# EasyEDA Pro project ProPrj_gzy_2025-03-24.epro

# Schematic Schematic1
Board Name: Board1; Create Date: 2025-03-19; Page Name: P1; Project Name: gzy; Schematic Name: Schematic1; Update Date: 2025-03-19; Company: 嘉立创EDA; Page Size: A4; Version: V1.0
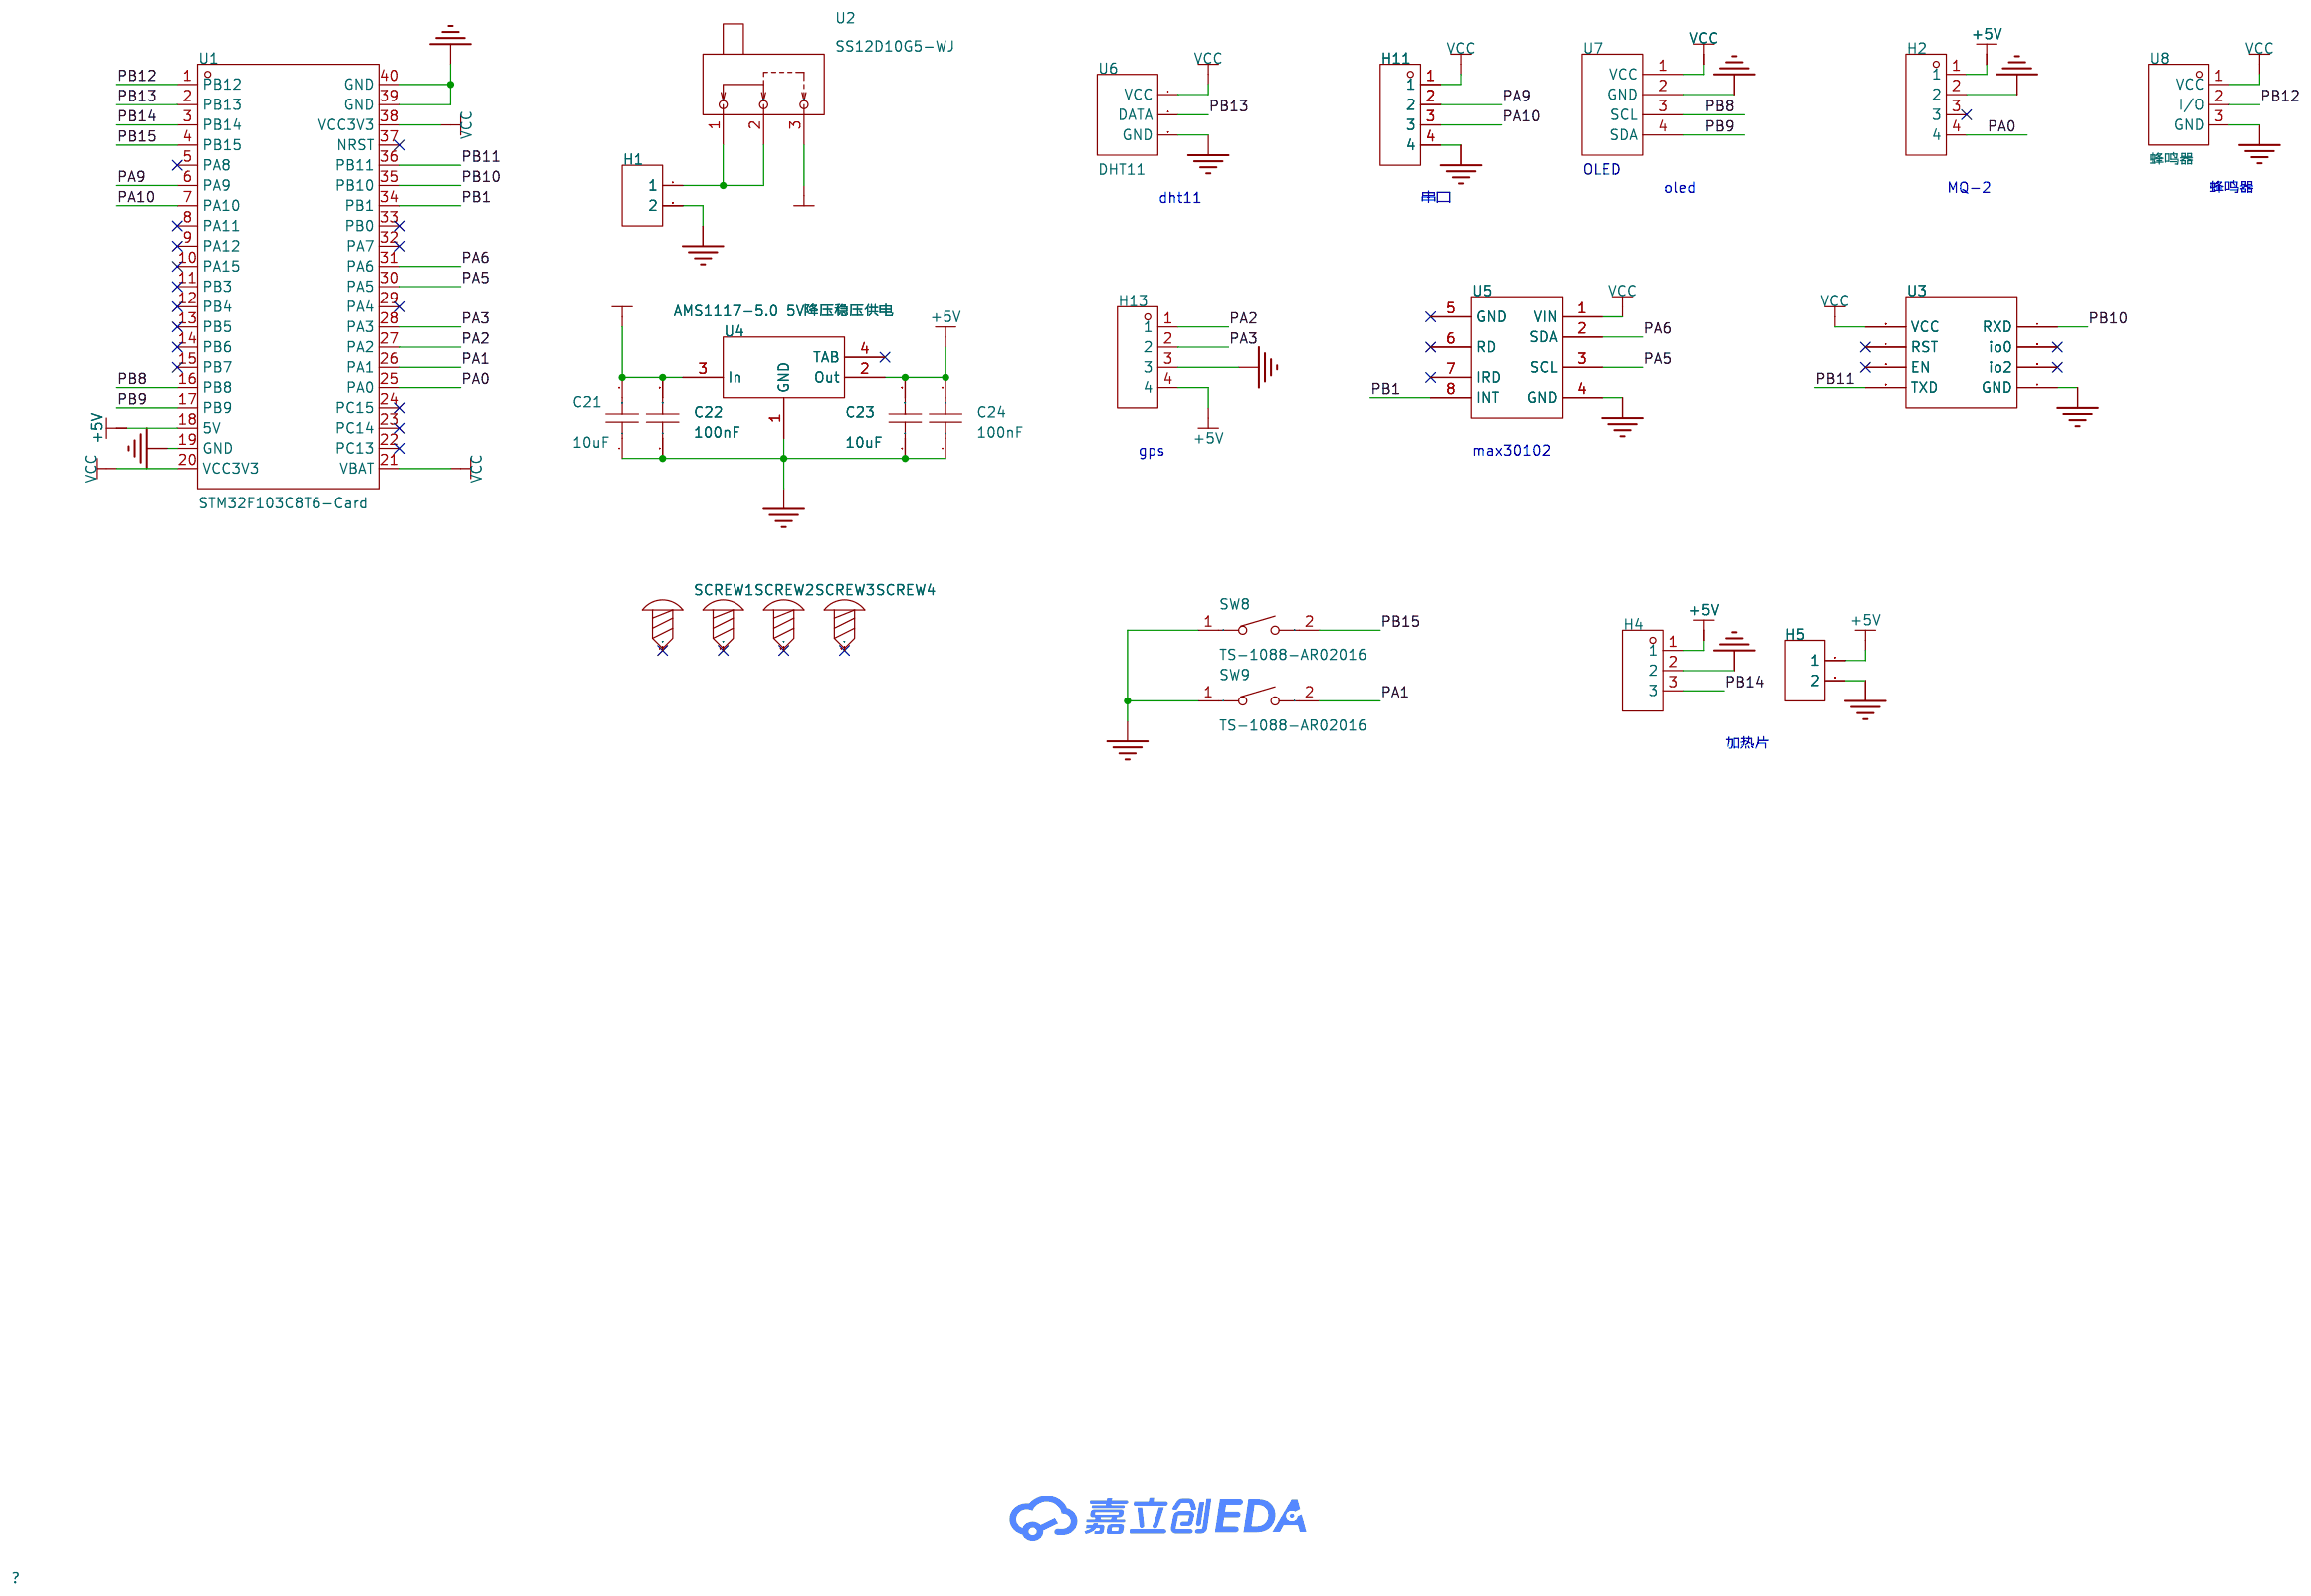
[diagram p0: schematic sheet]

## Parts
C21  10uF  [C0805]
C22  100nF  [C0805]
C23  10uF  [C0805]
C24  100nF  [C0805]
H1  -  [HDR-TH_2P-P2.54-V-F]
H2  -  [HDR-TH_4P-P2.54-V-F]
H4  -  [HDR-TH_3P-P2.54-V-F]
H5  -  [HDR-TH_2P-P2.54-V-F]
H11  -  [HDR-TH_4P-P2.54-V-F]
H13  -  [HDR-TH_4P-P2.54-V-F]
SCREW1  -  [M3螺丝]
SCREW2  -  [M3螺丝]
SCREW3  -  [M3螺丝]
SCREW4  -  [M3螺丝]
SW8  TS-1088-AR02016  [SW-SMD_L3.9-W3.0-P4.45]
SW9  TS-1088-AR02016  [SW-SMD_L3.9-W3.0-P4.45]
U1  STM32F103C8T6-Card  [CONN-TH_L53.3-W22.9_STM32F103C8T6-CARD]
U2  SS12D10G5-WJ  [SW-TH_3P-SS12D06-1]
U3  -  [esp8266-01s]
U4  AMS1117-5.0 5V降压稳压供电  [SOT-223_L6.5-W3.5-P2.30-LS7.0-BR]
U5  -  [MAX30102]
U6  DHT11  [DHT11_X]
U7  -  [0.96OLED_4P]
U8  蜂鸣器  [蜂鸣器]

## Library data of the parts
C21-C24 = CAP_0805: Supplier Footprint: 0805
H1 H5 = HDR-F_2.54_1x2P: Supplier Part: C49661; Supplier Footprint: 插件
H2 H11 H13 = HDR-F_2.54_1x4P: Supplier Part: C2718488; Supplier Footprint: 插件
H4 = HDR-F_2.54_1x3P: Supplier Part: C541850; Supplier Footprint: 插件
SCREW1-SCREW4 = M3螺丝: Supplier Footprint: 插件
SW8 SW9 = TS-1088-AR02016: 电路结构:单刀单掷;按钮形状:圆形按钮;作用力:160gf;安装方式:立贴;开关长度:4mm;开关宽度:3mm;开关高度:2mm;带支架:不带;触点电流:50mA;额定电压(DC):12V;绝缘电阻:100MΩ;机械寿命:10万次;; LCSC Part Name: 4*3*2mm 立贴 轻触开关; Supplier Part: C720477; Manufacturer: XUNPU(讯普); Supplier Footprint: SMD; JLCPCB Part Class: Extended Part; Datasheet: https://atta.szlcsc.com/upload/public/pdf/source/20200810/C720475_60D09DD6C54279ADDB2DC25100F1CC11.pdf; Supplier: LCSC; Circuit: 单刀单掷; Actuator Style: 圆形按钮; Operating Force: 160gf; Mounting Style: 立贴; Switch Length: 4mm; Switch Width: 3mm; Switch Height: 2mm; Strike Gundam: 不带; Contact Current: 50mA; Voltage Rating (DC): 12V; Insulation Resistance: 100MΩ; Actuator/Cap Color: 黑色; Pin Style: SMD接片; Mechanical Life: 10万次; Operating Temperature: -30℃~+80℃
U1 = STM32F103C8T6-Card: Supplier Part: C9900077949; Supplier Footprint: 插件; Supplier: LCSC
U2 = SS12D10G5-WJ: 电路结构:单刀双掷;安装方式:直插;额定电流(DC):2A;额定电压(DC):125V;机械寿命:3千次;; LCSC Part Name: 两档卧式插件 3脚拨动开关弯插 柄长5.0mm; Supplier Part: C7431058; Manufacturer: SHOU HAN(首韩); Supplier Footprint: 插件; JLCPCB Part Class: 扩展库; Datasheet: https://atta.szlcsc.com/upload/public/pdf/source/20230621/24203FB22DE8BDD2A5BD75F3B5E716C8.pdf; Supplier: LCSC; Circuit: 单刀双掷; Switch Length: 12.7mm; Switch Width: 6.7mm; Mounting Style: 直插; Current Rating (DC): 2A; Voltage Rating (DC): 125V; Mechanical Life: 3千次; Operating Temperature: -25℃~+70℃
U3 = esp8266-01s: esp8266-01swifi模块
U4 = AMS1117-5.0 5V降压稳压供电: Pin Type: IN; Supplier: LCSC; Manufacturer: AMS; Manufacturer Part: AMS1117-5.0; Supplier Part: C6187; JLCPCB Part Class: Basic Part
U5 = max30102: _: 3
U6 = DHT11: Supplier Part: C115245; Supplier: LCSC
U7 = OLED
U8 = 蜂鸣器: Supplier Part: C9900010938; Datasheet: https://atta.szlcsc.comnull; Supplier: LCSC

## Nets
+5V: C23.2 C24.2 H2.1 H4.1 H5.1 H13.4 U1.18(5V) U4.2(Out)
+7V: C21.2 C22.2 U2.3 U4.3(In)
GND: C21.1 C22.1 C23.1 C24.1 H1.2 H2.2 H4.2 H5.2 H11.4 H13.3 SW8.1 SW9.1 U1.19(GND) U1.39(GND) U1.40(GND) U3.1(GND) U4.1(GND) U5.4(GND) U6.3(GND) U7.2(GND) U8.3(GND)
VCC: H11.1 U1.20(VCC3V3) U1.21(VBAT) U1.38(VCC3V3) U3.8(VCC) U5.1(VIN) U6.1(VCC) U7.1(VCC) U8.1(VCC)
PA0: H2.4 U1.25(PA0)
PA1: SW9.2 U1.26(PA1)
PA2: H13.1 U1.27(PA2)
PA3: H13.2 U1.28(PA3)
PA5: U1.30(PA5) U5.3(SCL)
PA6: U1.31(PA6) U5.2(SDA)
PA9: H11.2 U1.6(PA9)
PA10: H11.3 U1.7(PA10)
PB1: U1.34(PB1) U5.8(INT)
PB8: U1.16(PB8) U7.3(SCL)
PB9: U1.17(PB9) U7.4(SDA)
PB10: U1.35(PB10) U3.4(RXD)
PB11: U1.36(PB11) U3.5(TXD)
PB12: U1.1(PB12) U8.2(I/O)
PB13: U1.2(PB13) U6.2(DATA)
PB14: H4.3 U1.3(PB14)
PB15: SW8.2 U1.4(PB15)
$1N445: H1.1 U2.1 U2.2

Not connected (* = marked no-connect by the designer): H2 3*; SCREW1 1*; SCREW2 1*; SCREW3 1*; SCREW4 1*; U1 5(PA8)* 8(PA11)* 9(PA12)* 10(PA15)* 11(PB3)* 12(PB4)* 13(PB5)* 14(PB6)* 15(PB7)* 22(PC13)* 23(PC14)* 24(PC15)* 29(PA4)* 32(PA7)* 33(PB0)* 37(NRST)*; U3 2(io2)* 3(io0)* 6(EN)* 7(RST)*; U4 4(TAB)*; U5 5(GND)* 6(RD)* 7(IRD)*

## Notes on the sheet
- oled
- MQ-2
- 蜂鸣器
- dht11
- 串口
- gps
- max30102
- 加热片

# Board PCB1
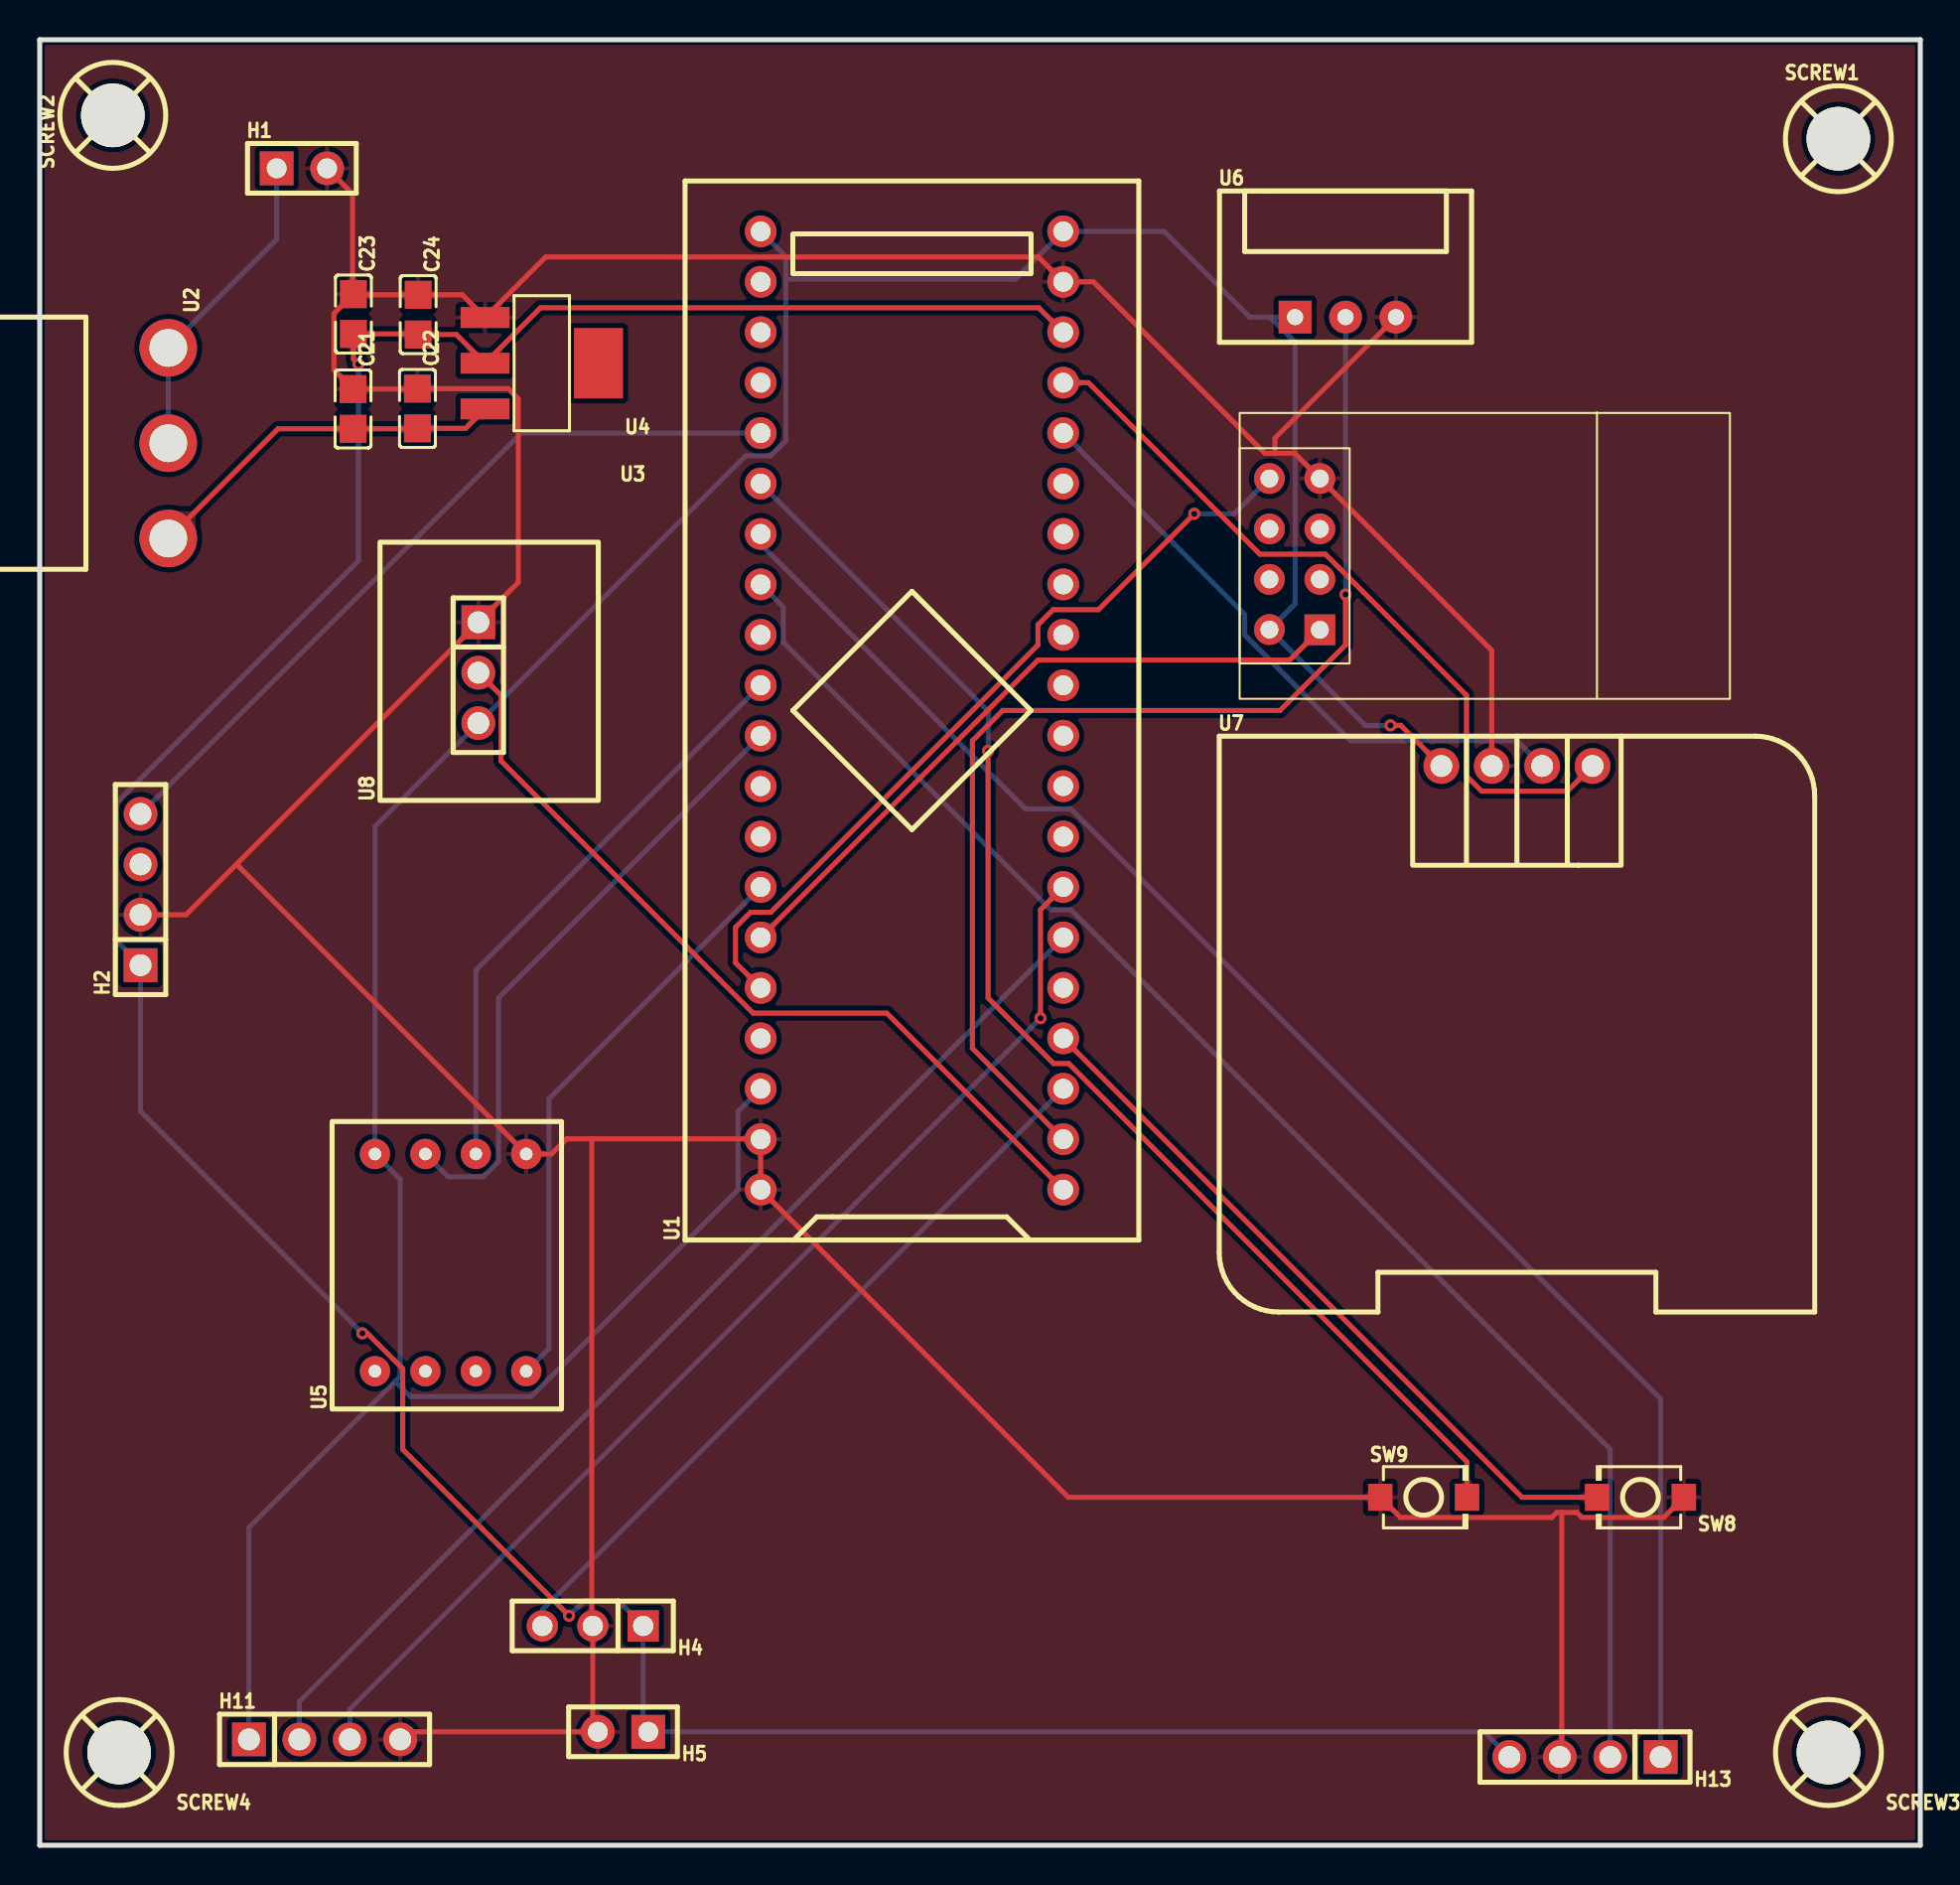
[diagram p1: board, top side]
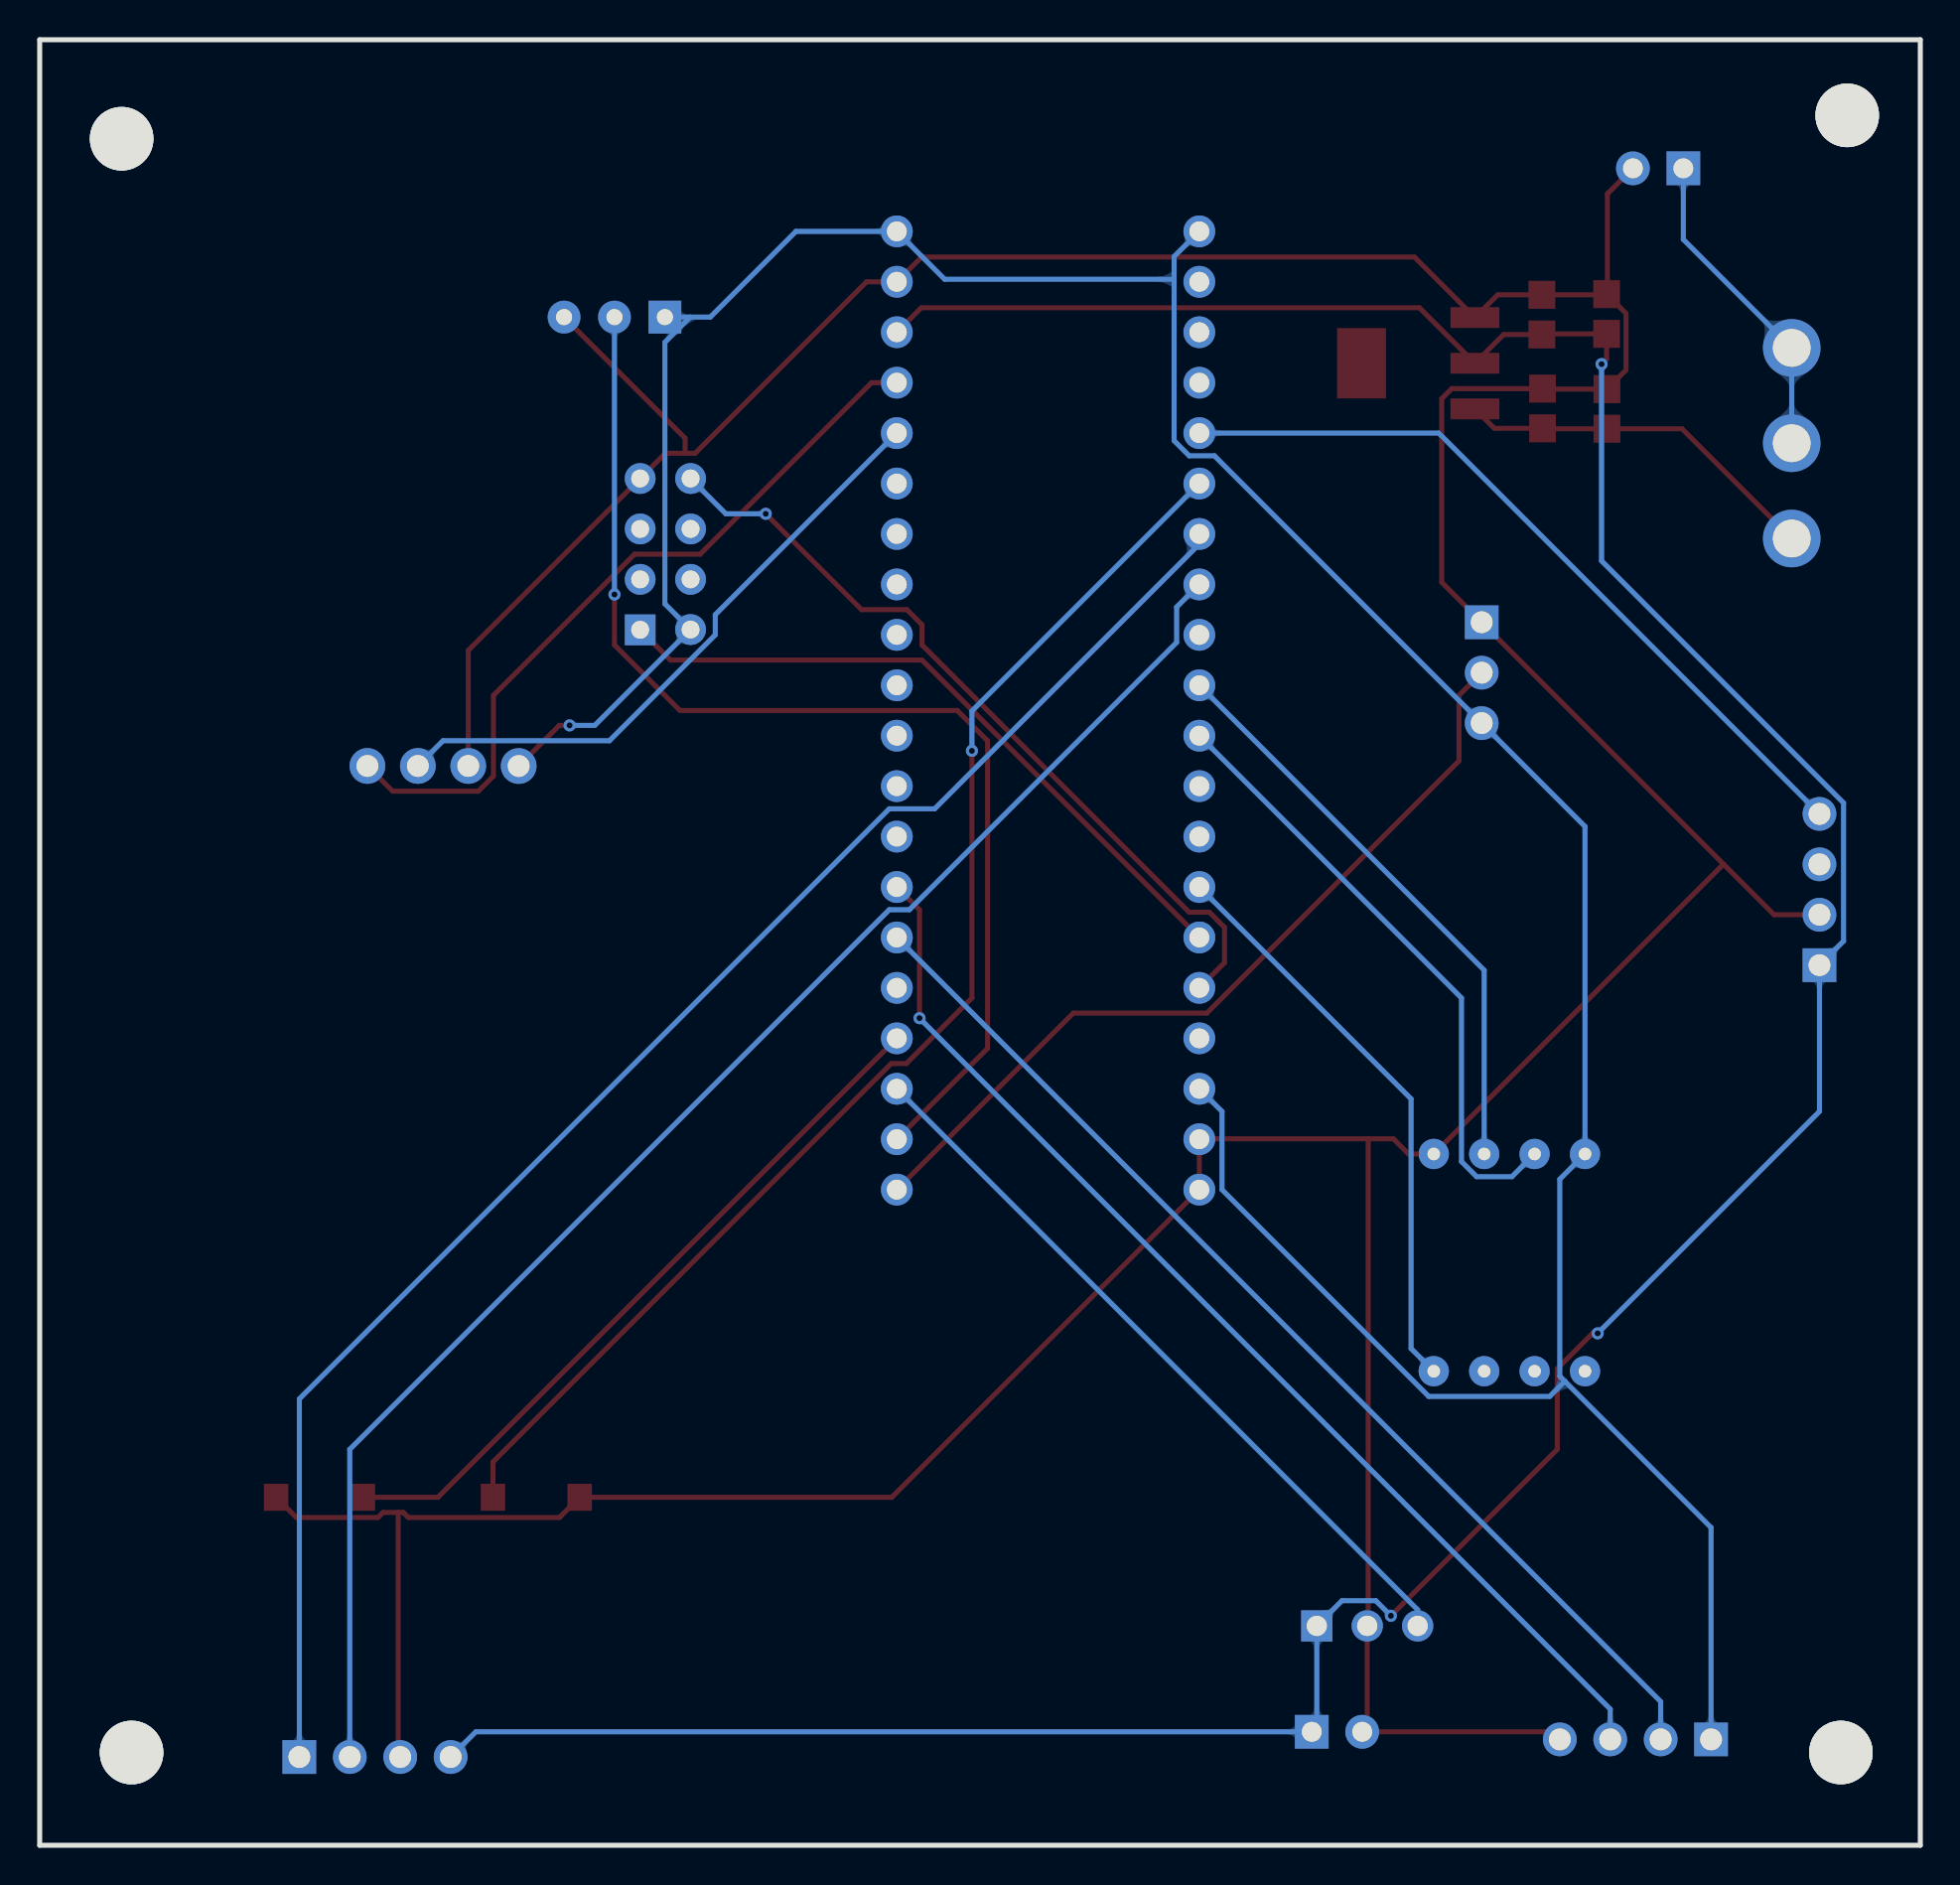
[diagram p2: board, bottom side, seen from below]

Outline 94.74 x 90.93 mm; copper layers: Top Layer, Bottom Layer. Coordinates in mm from the lower left corner of the outline.
Outline path: 0,90.93 0,0 94.74,0 94.74,90.93 0,90.93
Stack: Top Layer 0.035mm / Dielectric1 1.51mm FR4 er 4.5 / Bottom Layer 0.035mm

## Design rules (mm)
template: JLCPCB Capability(Two Layers Board)
spacing copperThickness1oz (default): track to track 0.102, other pairs 0.152 to 0.3
spacing copperThickness2oz: track to track 0.203, other pairs 0.152 to 0.3
track width copperThickness1oz (default): min 0.127, default 0.254, max 2.54
track width copperThickness2oz: min 0.203, default 0.254, max 2.54
differential pair differentialPair (default): width min 0.127, default 0.254, max 2.54; gap min 0.152, default 0.152
via viaSize (default): diameter min 0.5, default 0.61, max 10; hole min 0.3, default 0.305, max 6.3

## Placement (name value [footprint] x y rotation side)
C21  10uF  [C0805]  15.78 72.34 270 top
C22  100nF  [C0805]  19.03 72.36 270 top
C23  10uF  [C0805]  15.8 77.12 270 top
C24  100nF  [C0805]  19.07 77.09 270 top
H1  -  [HDR-TH_2P-P2.54-V-F]  13.21 84.45 0 top
H2  -  [HDR-TH_4P-P2.54-V-F]  5.08 48.13 90 top
H4  -  [HDR-TH_3P-P2.54-V-F]  27.86 11.05 180 top
H5  -  [HDR-TH_2P-P2.54-V-F]  29.39 5.72 180 top
H11  -  [HDR-TH_4P-P2.54-V-F]  14.35 5.33 0 top
H13  -  [HDR-TH_4P-P2.54-V-F]  77.85 4.44 180 top
SCREW1  -  [M3螺丝]  90.61 85.94 0 top
SCREW2  -  [M3螺丝]  3.68 87.12 90 top
SCREW3  -  [M3螺丝]  90.11 4.67 180 top
SCREW4  -  [M3螺丝]  4 4.67 180 top
SW8  TS-1088-AR02016  [SW-SMD_L3.9-W3.0-P4.45]  80.64 17.53 180 top
SW9  TS-1088-AR02016  [SW-SMD_L3.9-W3.0-P4.45]  69.72 17.53 0 top
U1  STM32F103C8T6-Card  [CONN-TH_L53.3-W22.9_STM32F103C8T6-CARD]  43.94 57.15 90 top
U2  SS12D10G5-WJ  [SW-TH_3P-SS12D06-1]  6.48 70.61 270 top
U3  -  [esp8266-01s]  69.09 68.96 270 top
U4  AMS1117-5.0 5V降压稳压供电  [SOT-223_L6.5-W3.5-P2.30-LS7.0-BR]  25.29 74.64 180 top
U5  -  [MAX30102]  25.53 23.62 90 top
U6  DHT11  [DHT11_X]  65.79 76.96 0 top
U7  -  [0.96OLED_4P]  74.42 54.36 0 top
U8  -  [蜂鸣器]  21.97 59.31 90 top

## Footprints (pads in the part's own frame, mm; a bottom-side part is the same pattern mirrored in y, then rotated)
0.96OLED_4P
  round 1.8 hole 1.1: 1(-3.81,-0.002) 2(-1.27,0.002) 3(1.27,0.002) 4(3.81,0.002)
C0805
  rect 1.41x1.35 smd: 1(-1,0) 2(1,0)
CONN-TH_L53.3-W22.9_STM32F103C8T6-CARD
  round 1.6 hole 1: 1(-24.13,-7.62) 2(-21.59,-7.62) 3(-19.05,-7.62) 4(-16.51,-7.62) 5(-13.97,-7.62) 6(-11.43,-7.62) 7(-8.89,-7.62) 8(-6.35,-7.62) 9(-3.81,-7.62) 10(-1.27,-7.62) 11(1.27,-7.62) 12(3.81,-7.62) 13(6.35,-7.62) 14(8.89,-7.62) 15(11.43,-7.62) 16(13.97,-7.62) 17(16.51,-7.62) 18(19.05,-7.62) 19(21.59,-7.62) 20(24.13,-7.62) 21(24.13,7.62) 22(21.59,7.62) 23(19.05,7.62) 24(16.51,7.62) 25(13.97,7.62) 26(11.43,7.62) 27(8.89,7.62) 28(6.35,7.62) 29(3.81,7.62) 30(1.27,7.62) 31(-1.27,7.62) 32(-3.81,7.62) 33(-6.35,7.62) 34(-8.89,7.62) 35(-11.43,7.62) 36(-13.97,7.62) 37(-16.51,7.62) 38(-19.05,7.62) 39(-21.59,7.62) 40(-24.13,7.62)
DHT11_X
  rect 1.651x1.651 hole 0.81: 1(-2.54,0)
  round 1.651 hole 0.81: 2(0,0) 3(2.54,0)
esp8266-01s
  round 1.55 hole 0.9: 1(0.127,-4.596) 2(2.667,-4.596) 3(5.207,-4.596) 5(0.127,-7.136) 6(2.667,-7.136) 7(5.207,-7.136) 8(7.734,-7.136)
  rect 1.55x1.55 hole 0.9: 4(7.747,-4.596)
HDR-TH_2P-P2.54-V-F
  rect 1.7x1.7 hole 1: 1(-1.27,0)
  round 1.7 hole 1: 2(1.27,0)
HDR-TH_3P-P2.54-V-F
  rect 1.575x1.575 hole 1.02: 1(-2.54,0)
  round 1.575 hole 1.02: 2(0,0) 3(2.54,0)
HDR-TH_4P-P2.54-V-F
  rect 1.7x1.7 hole 1.1: 1(-3.81,0)
  round 1.7 hole 1.1: 2(-1.27,0) 3(1.27,0) 4(3.81,0)
M3螺丝
  round 3.2 hole 3.2: 1(0,0)
MAX30102
  round 1.524 hole 0.635: 1(11.194,8.636) 2(11.194,6.096) 3(11.194,3.556) 4(11.194,1.016) 5(0.254,8.636) 6(0.254,6.096) 7(0.254,3.556) 8(0.254,1.016)
SOT-223_L6.5-W3.5-P2.30-LS7.0-BR
  rect 2.465x1.05 smd: 1(2.857,-2.3) 2(2.857,0) 3(2.857,2.3)
  rect 2.465x3.54 smd: 4(-2.857,0)
SW-SMD_L3.9-W3.0-P4.45
  rect 1.23x1.36 smd: 1(-2.185,0) 2(2.185,0)
SW-TH_3P-SS12D06-1
  round 2.9 hole 1.9: 1(-4.8,0) 2(0,0) 3(4.8,0)
蜂鸣器
  round 1.7 hole 1.1: 1(-2.794,-0.127) 2(-0.254,-0.127)
  rect 1.7x1.7 hole 1.1: 3(2.286,-0.127)

## Nets
As in the schematic.

Pads without a net: H2 3; SCREW1 1; SCREW2 1; SCREW3 1; SCREW4 1; U1 5 8 9 10 11 12 13 14 15 22 23 24 29 32 33 37; U3 2 3 6 7; U4 4; U5 5 6 7

## Via types
v1: diameter 0.61, hole 0.305, Top Layer to Bottom Layer, 8 vias

## Routing (per net, layer and track width the routed paths; a pad name or vN(x,y) marks a point on that pad's centre or on a via; arc(x,y) is an arc through that point)
+5V: length 171.3
  Top Layer w0.254: U1.18 50.33,77.43 25.23,77.43 U4.2 20.99,76.09 C24.2 19.03,76.12 C23.2 15.8,74.85 v1(16.06,74.59) ; v1(16.26,25.78) 16.51,25.78 18.29,24 18.29,19.94 v1(26.67,11.56)
  Bottom Layer w0.254: H13.4 72.77,5.72 H5.1 30.4,5.97 H4.1 29.13,12.32 27.43,12.32 v1(26.67,11.56) ; v1(16.06,74.59) 16.06,64.69 3.87,52.5 3.87,45.54 H2.1 5.08,36.96 v1(16.26,25.78)
+7V: length 18.7
  Top Layer w0.254: U2.3 12,71.34 C21.2 19.01,71.34 C22.2 21.46,71.36 U4.3
GND: length 280.5
  Top Layer w0.254: H11.4 18.54,5.72 H5.2 27.86,5.97 H4.2 27.81,11.1 27.81,35.58 ; 27.81,35.58 36.3,35.58 U1.39 U1.40 51.82,17.53 SW9.1 68.55,16.51 76.17,16.51 76.43,16.76 76.68,16.76 ; 27.81,35.58 26.54,35.58 25.78,34.82 U5.4 9.92,49.4 9.91,49.4 ; 62.23,70.1 62.23,70.87 68.33,76.96 ; 62.23,70.1 61.72,70.1 53.09,78.74 U1.19 50.32,79.99 25.48,79.99 U4.1 21.29,78.09 C24.1 15.76,78.09 ; 62.23,70.1 63.22,70.1 U3.1 73.15,60.17 U7.2 ; H1.2 15.76,83.17 15.76,78.09 ; 9.91,49.4 7.37,46.86 H2.2 ; 9.91,49.4 U8.3 24.11,63.61 24.11,72.85 23.6,73.36 C22.1 19.01,73.34 C21.1 14.83,74.3 14.83,77.15 15.76,78.09 ; 76.68,16.76 77.44,16.76 77.7,16.51 81.81,16.51 SW8.1 ; 76.68,16.76 76.68,4.55 H13.3
VCC: length 173.7
  Top Layer w0.254: v1(68.05,56.4) 68.57,56.4 U7.1
  Bottom Layer w0.254: 17.91,23.37 18.67,22.61 24.77,22.61 35.18,33.02 35.18,36.96 U1.38 ; 17.91,23.37 10.54,16 H11.1 ; 17.91,23.37 18.16,23.62 18.16,33.55 U5.1 16.89,51.31 U8.1 35.56,69.98 36.83,69.98 37.59,70.74 37.59,78.87 ; 37.59,78.87 49.15,78.87 U1.20 56.64,81.28 60.96,76.96 61.98,76.96 ; 37.59,78.87 37.59,80.01 U1.21 ; v1(68.05,56.4) 66.78,56.4 U3.8 63.25,62.52 63.25,75.69 61.98,76.96 ; 61.98,76.96 U6.1
PA0: length 39.2
  Bottom Layer w0.254: H2.4 24.26,71.12 U1.25
PA1: length 66.2
  Top Layer w0.254: v1(47.78,55.12) 47.78,42.67 51.08,39.37 51.84,39.37 71.91,19.3 SW9.2
  Bottom Layer w0.254: U1.26 47.78,57.12 v1(47.78,55.12)
PA2: length 81.7
  Bottom Layer w0.254: H13.1 81.66,22.48 51.94,52.2 49.66,52.2 36.45,65.4 36.45,65.91 U1.27
PA3: length 77.4
  Bottom Layer w0.254: H13.2 79.12,19.94 51.94,47.12 50.93,47.12 37.46,60.58 37.46,62.36 U1.28
PA5: length 29.5
  Bottom Layer w0.254: U5.3 21.97,44.07 U1.30
PA6: length 31.4
  Bottom Layer w0.254: U1.31 23.11,42.67 23.11,34.43 22.35,33.67 20.57,33.67 U5.2
PA9: length 56.3
  Bottom Layer w0.254: U1.6 13.08,7.24 H11.2
PA10: length 57.8
  Top Layer w0.254: U1.7 50.42,47.12 v1(50.42,41.66)
  Bottom Layer w0.254: v1(50.42,41.66) 15.62,6.86 H11.3
PB1: length 29.3
  Bottom Layer w0.254: U5.8 25.65,25.02 25.65,37.59 U1.34
PB8: length 31.7
  Bottom Layer w0.254: 75.69,54.36 74.42,55.63 66.04,55.63 60.71,60.96 60.71,61.98 U1.16
PB9: length 38.1
  Top Layer w0.254: U1.17 52.83,73.66 61.47,65.02 64.77,65.02 71.88,57.91 71.88,53.85 72.64,53.09 76.96,53.09 U7.4
PB10: length 34.6
  Top Layer w0.254: U3.4 62.97,59.69 50.29,59.69 U1.35
PB11: length 40.4
  Top Layer w0.254: U1.36 35.05,44.45 35.05,46.23 35.81,46.99 36.83,46.99 50.29,60.45 50.29,61.47 51.05,62.23 53.34,62.23 v1(58.17,67.06)
  Bottom Layer w0.254: v1(58.17,67.06) 60.17,67.06 U3.5
PB12: length 42.2
  Top Layer w0.254: U1.1 42.67,41.91 35.94,41.91 23.24,54.61 23.24,57.91 U8.2
PB13: length 59.3
  Top Layer w0.254: U1.2 46.99,40.13 46.99,55.63 48.51,57.15 62.48,57.15 65.79,60.45 v1(65.79,62.99)
  Bottom Layer w0.254: v1(65.79,62.99) U6.2
PB14: length 37.9
  Bottom Layer w0.254: U1.3 25.32,11.86 H4.3
PB15: length 36.5
  Top Layer w0.254: U1.4 74.68,17.53 SW8.2
$1N445: length 16.1
  Bottom Layer w0.254: H1.1 11.94,80.87 U2.1 U2.2

## Copper pours and planes (outline as drawn; the poured copper is in the pictures)
GND on Top Layer: -14.73,101.73 102.62,101.73 102.62,-12.32 -14.73,-12.32

Small or netless copper shapes (teardrops, artwork), in the pictures only: 74 on Top Layer, 58 on Bottom Layer
